# Altium project MicrocontrollerBoard.PrjPcb
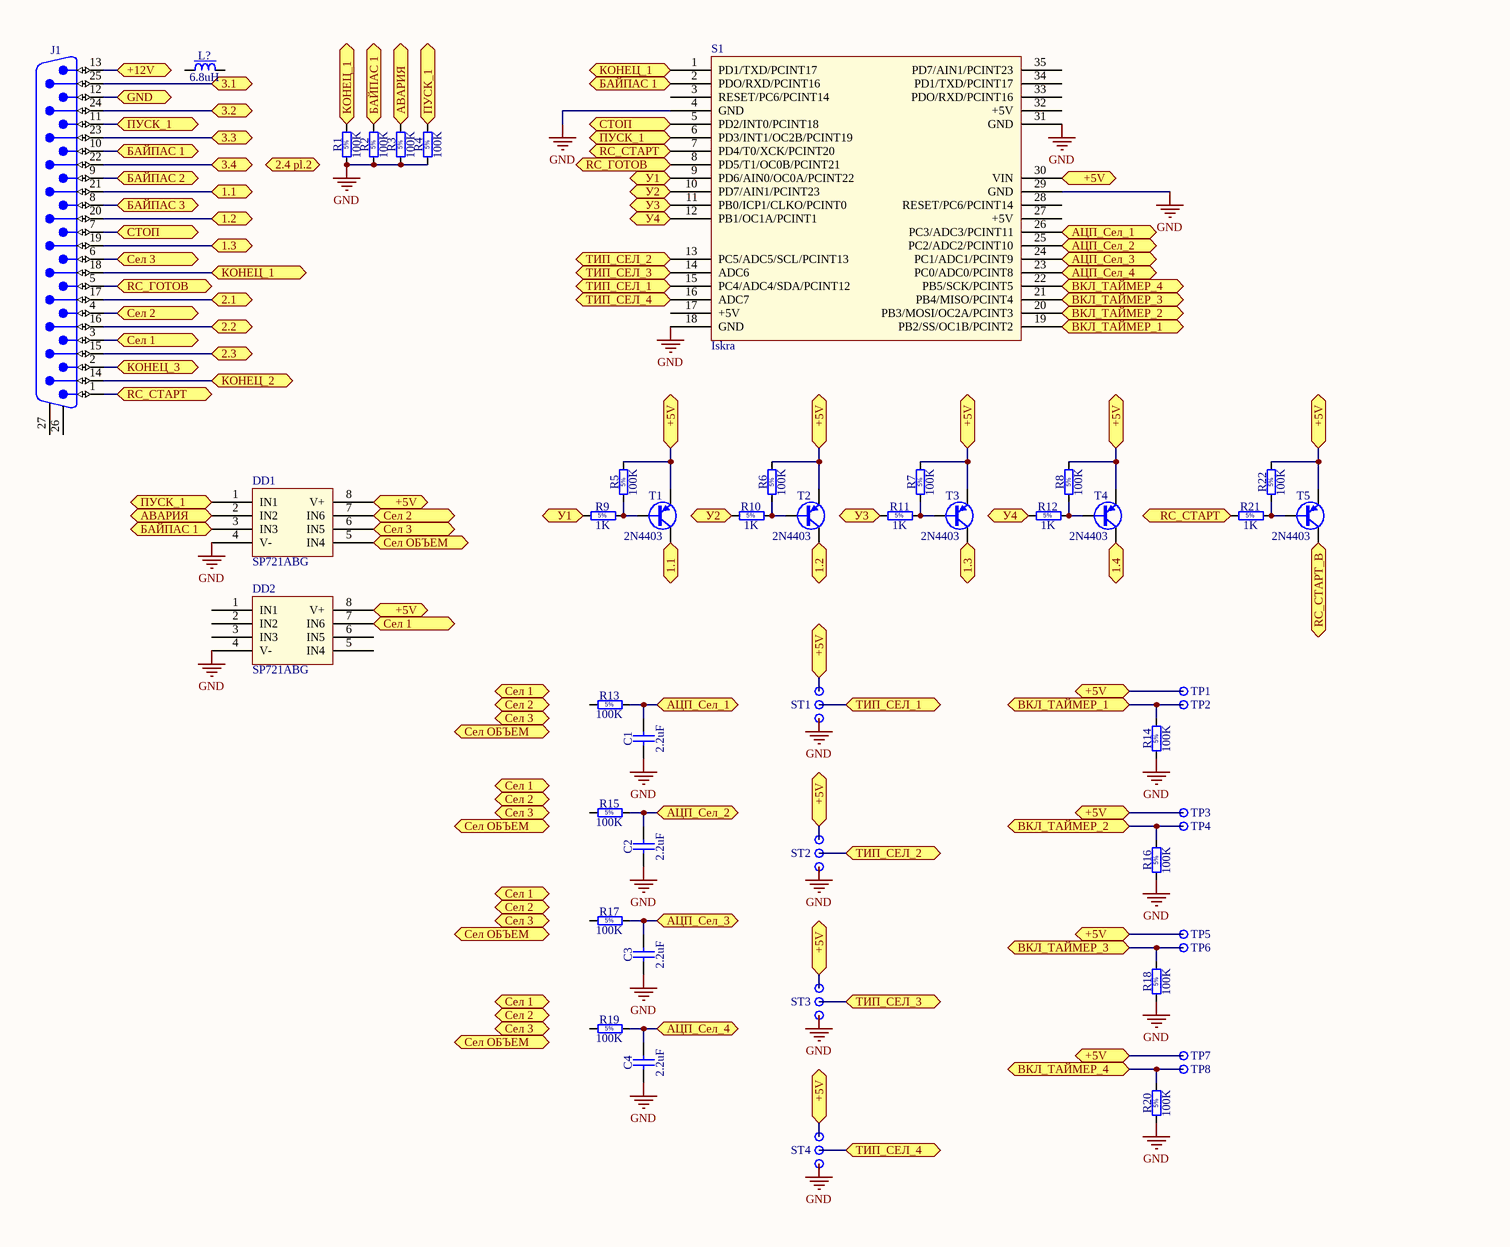
[diagram p0: TimerModule.SchDoc, left]
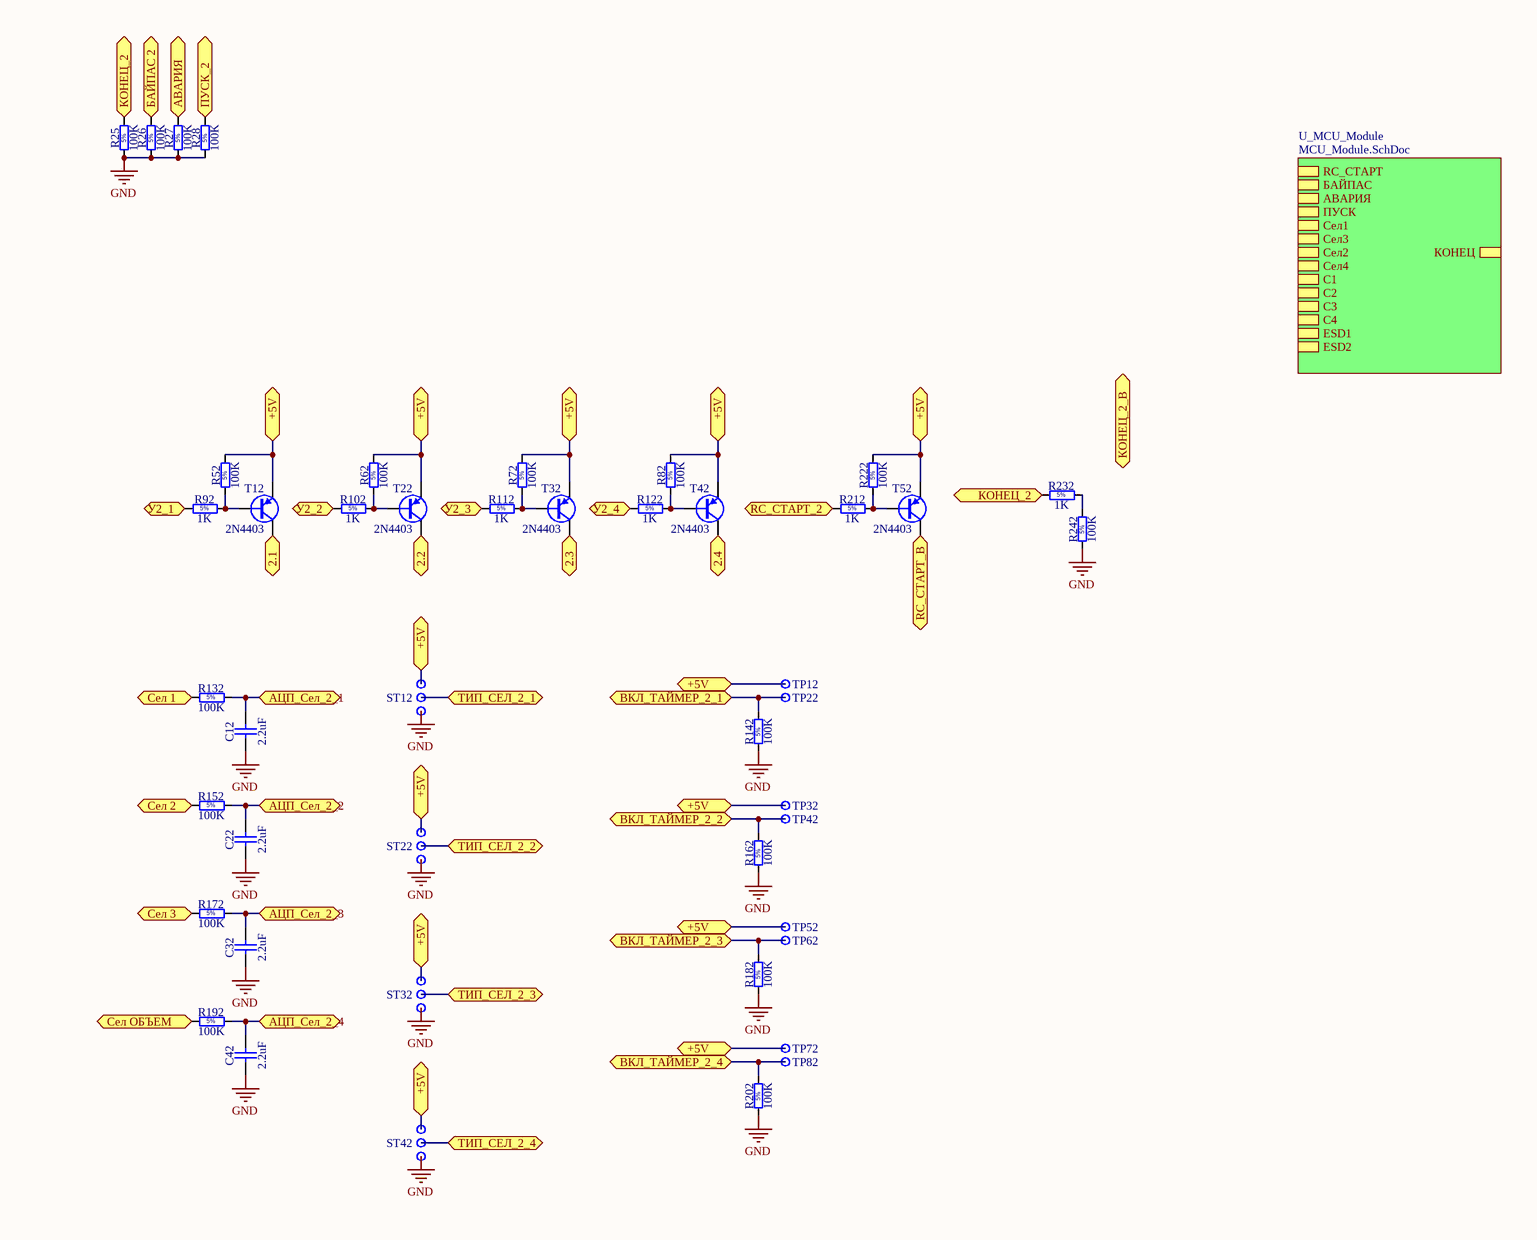
[diagram p1: TimerModule.SchDoc, right]
4 sheets, 159 parts. Net scope: hierarchical (ports join the sheet entries above them; power ports are global).
Board file: Timermodule.PcbDoc
Sheets:
  TimerModule.SchDoc
    U_MCU_Module = MCU_Module.SchDoc
      PNP1 = PNP_Cell.SchDoc
      PNP2 = PNP_Cell.SchDoc
      PNP3 = PNP_Cell.SchDoc
      PNP4 = PNP_Cell.SchDoc
      FILT1 = ADC_Filter_Cell.SchDoc
      FILT2 = ADC_Filter_Cell.SchDoc
      FILT3 = ADC_Filter_Cell.SchDoc
      FILT4 = ADC_Filter_Cell.SchDoc
      U_PNP_Cell = PNP_Cell.SchDoc

## Sheet TimerModule.SchDoc
size A1

### Parts
(Parts that share a designator on the sheet are numbered #1, #2 ... from top to bottom, then left to right.)
B1  Plated Hole  [MTG300_700]  (value not drawn)
B2  Plated Hole  [MTG300_700]  (value not drawn)
B3  Plated Hole  [MTG300_700]  (value not drawn)
B4  Plated Hole  [MTG300_700]  (value not drawn)
B5  Plated Hole  [MTG300_700]  (value not drawn)
B6  Plated Hole  [MTG300_700]  (value not drawn)
B7  Plated Hole  [MTG300_700]  (value not drawn)
B8  Plated Hole  [MTG300_700]  (value not drawn)
B12#1  Plated Hole  [MTG300_700]  (value not drawn)
B22#1  Plated Hole  [MTG300_700]  (value not drawn)
B32  Plated Hole  [MTG300_700]  (value not drawn)
B42  Plated Hole  [MTG300_700]  (value not drawn)
B52  Plated Hole  [MTG300_700]  (value not drawn)
B62  Plated Hole  [MTG300_700]  (value not drawn)
B72  Plated Hole  [MTG300_700]  (value not drawn)
B82  Plated Hole  [MTG300_700]  (value not drawn)
C1  2.2uF  [CAPRR254-254X381X508]
C2  2.2uF  [CAPRR254-254X381X508]
C3  2.2uF  [CAPRR254-254X381X508]
C4  2.2uF  [CAPRR254-254X381X508]
C12  2.2uF  [CAPRR254-254X381X508]
C22  2.2uF  [CAPRR254-254X381X508]
C32  2.2uF  [CAPRR254-254X381X508]
C42  2.2uF  [CAPRR254-254X381X508]
DD1#1  SP721ABG  [SOIC127P594X363-8N]
DD2#1  SP721ABG  [SOIC127P594X363-8N]
J1  D-Sub  [AMPHENOL_L717DFB25P1ATN]  (value not drawn)
L?  6.8uH  [IND_WURTH_WE-TI]
R1#1  100K  [RES_ARCOL_RCC025]
R2#1  100K  [RES_ARCOL_RCC025]
R3#1  100K  [RES_ARCOL_RCC025]
R4#1  100K  [RES_ARCOL_RCC025]
R5  100K  [RES_ARCOL_RCC025]
R6  100K  [RES_ARCOL_RCC025]
R7  100K  [RES_ARCOL_RCC025]
R8  100K  [RES_ARCOL_RCC025]
R9  1K  [RES_ARCOL_RCC025]
R10  1K  [RES_ARCOL_RCC025]
R11  1K  [RES_ARCOL_RCC025]
R12  1K  [RES_ARCOL_RCC025]
R13  100K  [RES_ARCOL_RCC025]
R14  100K  [RES_ARCOL_RCC025]
R15  100K  [RES_ARCOL_RCC025]
R16  100K  [RES_ARCOL_RCC025]
R17  100K  [RES_ARCOL_RCC025]
R18  100K  [RES_ARCOL_RCC025]
R19  100K  [RES_ARCOL_RCC025]
R20  100K  [RES_ARCOL_RCC025]
R21  1K  [RES_ARCOL_RCC025]
R22  100K  [RES_ARCOL_RCC025]
R25  100K  [RES_ARCOL_RCC025]
R26  100K  [RES_ARCOL_RCC025]
R27  100K  [RES_ARCOL_RCC025]
R28  100K  [RES_ARCOL_RCC025]
R52  100K  [RES_ARCOL_RCC025]
R62  100K  [RES_ARCOL_RCC025]
R72  100K  [RES_ARCOL_RCC025]
R82  100K  [RES_ARCOL_RCC025]
R92  1K  [RES_ARCOL_RCC025]
R102  1K  [RES_ARCOL_RCC025]
R112  1K  [RES_ARCOL_RCC025]
R122  1K  [RES_ARCOL_RCC025]
R132  100K  [RES_ARCOL_RCC025]
R142  100K  [RES_ARCOL_RCC025]
R152  100K  [RES_ARCOL_RCC025]
R162  100K  [RES_ARCOL_RCC025]
R172  100K  [RES_ARCOL_RCC025]
R182  100K  [RES_ARCOL_RCC025]
R192  100K  [RES_ARCOL_RCC025]
R202  100K  [RES_ARCOL_RCC025]
R212  1K  [RES_ARCOL_RCC025]
R222  100K  [RES_ARCOL_RCC025]
R232  1K  [RES_ARCOL_RCC025]
R242  100K  [RES_ARCOL_RCC025]
S1#1  Iskra  [Iskra]
ST1#1  Plated Hole  [MTG300_700]  (value not drawn)
ST2#1  Plated Hole  [MTG300_700]  (value not drawn)
ST3#1  Plated Hole  [MTG300_700]  (value not drawn)
ST4#1  Plated Hole  [MTG300_700]  (value not drawn)
ST12  Plated Hole  [MTG300_700]  (value not drawn)
ST22  Plated Hole  [MTG300_700]  (value not drawn)
ST32  Plated Hole  [MTG300_700]  (value not drawn)
ST42  Plated Hole  [MTG300_700]  (value not drawn)
T1  2N4403  [TO-92AA-P254]
T2  2N4403  [TO-92AA-P254]
T3  2N4403  [TO-92AA-P254]
T4  2N4403  [TO-92AA-P254]
T5  2N4403  [TO-92AA-P254]
T12  2N4403  [TO-92AA-P254]
T22  2N4403  [TO-92AA-P254]
T32  2N4403  [TO-92AA-P254]
T42  2N4403  [TO-92AA-P254]
T52  2N4403  [TO-92AA-P254]
TP1#1  Test Point  [TPS127]  (value not drawn)
TP2#1  Test Point  [TPS127]  (value not drawn)
TP3#1  Test Point  [TPS127]  (value not drawn)
TP4#1  Test Point  [TPS127]  (value not drawn)
TP5#1  Test Point  [TPS127]  (value not drawn)
TP6  Test Point  [TPS127]  (value not drawn)
TP7  Test Point  [TPS127]  (value not drawn)
TP8  Test Point  [TPS127]  (value not drawn)
TP12  Test Point  [TPS127]  (value not drawn)
TP22  Test Point  [TPS127]  (value not drawn)
TP32  Test Point  [TPS127]  (value not drawn)
TP42  Test Point  [TPS127]  (value not drawn)
TP52  Test Point  [TPS127]  (value not drawn)
TP62  Test Point  [TPS127]  (value not drawn)
TP72  Test Point  [TPS127]  (value not drawn)
TP82  Test Point  [TPS127]  (value not drawn)

### Sub-sheets
U_MCU_Module = MCU_Module.SchDoc: RC_СТАРТ, БАЙПАС, АВАРИЯ, ПУСК, Сел1, Сел3, Сел2, Сел4, С1, С2, С3, С4, ESD1, ESD2, КОНЕЦ

### Ports
1.1, 1.2, 1.3, 1.4, 2.1, 2.2, 2.3, 2.4, 2.4 pl.2, 3.1, 3.2, 3.3, 3.4, +5V, +12V, GND, RC_ГОТОВ, RC_СТАРТ, RC_СТАРТ_2, RC_СТАРТ_В, АВАРИЯ, АЦП_Сел_1, АЦП_Сел_2, АЦП_Сел_2_1, АЦП_Сел_2_2, АЦП_Сел_2_3, АЦП_Сел_2_4, АЦП_Сел_3, АЦП_Сел_4, БАЙПАС 1, БАЙПАС 2, БАЙПАС 3, ВКЛ_ТАЙМЕР_1, ВКЛ_ТАЙМЕР_2, ВКЛ_ТАЙМЕР_2_1, ВКЛ_ТАЙМЕР_2_2, ВКЛ_ТАЙМЕР_2_3, ВКЛ_ТАЙМЕР_2_4, ВКЛ_ТАЙМЕР_3, ВКЛ_ТАЙМЕР_4, КОНЕЦ_1, КОНЕЦ_2, КОНЕЦ_2_В, КОНЕЦ_3, ПУСК_1, ПУСК_2, Сел 1, Сел 2, Сел 3, Сел ОБЪЕМ, СТОП, ТИП_СЕЛ_1, ТИП_СЕЛ_2, ТИП_СЕЛ_2_1, ТИП_СЕЛ_2_2, ТИП_СЕЛ_2_3, ТИП_СЕЛ_2_4, ТИП_СЕЛ_3, ТИП_СЕЛ_4, У1, У2, У2_1, У2_2, У2_3, У2_4, У3, У4

### Nets
GND: B2.1 B4.1 B6.1 B8.1 B22#1.1 B42.1 B62.1 B82.1 C1.1 C2.1 C3.1 C4.1 C12.1 C22.1 C32.1 C42.1 DD1#1.4(V-) DD2#1.4(V-) R1#1.1 R2#1.1 R3#1.1 R4#1.1 R14.1 R16.1 R18.1 R20.1 R25.1 R26.1 R27.1 R28.1 R142.1 R162.1 R182.1 R202.1 R242.1 S1#1.4(GND) S1#1.18(GND) S1#1.29(GND) S1#1.31(GND)
NetB1_1: B1.1 B3.1 B5.1 B7.1 B12#1.1 B32.1 B52.1 B72.1 DD1#1.8(V+) DD2#1.8(V+) R5.2 R6.2 R7.2 R8.2 R22.2 R52.2 R62.2 R72.2 R82.2 R222.2 S1#1.30(VIN) T1.1(E) T2.1(E) T3.1(E) T4.1(E) T5.1(E) T12.1(E) T22.1(E) T32.1(E) T42.1(E) T52.1(E) TP1#1.1 TP3#1.1 TP5#1.1 TP7.1 TP12.1 TP32.1 TP52.1 TP72.1 ; port +5V
NetC1_2: C1.2 R13.2 S1#1.26(PC3/ADC3/PCINT11) ; port АЦП_Сел_1
NetC2_2: C2.2 R15.2 S1#1.25(PC2/ADC2/PCINT10) ; port АЦП_Сел_2
NetC3_2: C3.2 R17.2 S1#1.24(PC1/ADC1/PCINT9) ; port АЦП_Сел_3
NetC4_2: C4.2 R19.2 S1#1.23(PC0/ADC0/PCINT8) ; port АЦП_Сел_4
NetC12_2: C12.2 R132.2 ; port АЦП_Сел_2_1
NetC22_2: C22.2 R152.2 ; port АЦП_Сел_2_2
NetC32_2: C32.2 R172.2 ; port АЦП_Сел_2_3
NetC42_2: C42.2 R192.2 ; port АЦП_Сел_2_4
NetDD1#1_1: DD1#1.1(IN1) J1.11 R4#1.2 S1#1.6(PD3/INT1/OC2B/PCINT19) ; port ПУСК_1
NetDD1#1_2: DD1#1.2(IN2) R3#1.2 R27.2 ; port АВАРИЯ
NetDD1#1_3: DD1#1.3(IN3) J1.10 R2#1.2 S1#1.2(PDO/RXD/PCINT16) ; port БАЙПАС 1
NetDD1#1_5: DD1#1.5(IN4) R192.1 ; port Сел ОБЪЕМ
NetDD1#1_6: DD1#1.6(IN5) J1.6 R172.1 ; port Сел 3
NetDD1#1_7: DD1#1.7(IN6) J1.4 R152.1 ; port Сел 2
NetDD2#1_7: DD2#1.7(IN6) J1.3 R132.1 ; port Сел 1
NetJ1_1: J1.1 R21.1 S1#1.7(PD4/T0/XCK/PCINT20) ; port RC_СТАРТ
NetJ1_2: J1.2 ; port КОНЕЦ_3
NetJ1_5: J1.5 S1#1.8(PD5/T1/OC0B/PCINT21) ; port RC_ГОТОВ
NetJ1_7: J1.7 S1#1.5(PD2/INT0/PCINT18) ; port СТОП
NetJ1_8: J1.8 ; port БАЙПАС 3
NetJ1_9: J1.9 R26.2 ; port БАЙПАС 2
NetJ1_12: J1.12 ; port GND
NetJ1_13: J1.13 ; port +12V
NetJ1_14: J1.14 R25.2 R232.1 ; port КОНЕЦ_2
NetJ1_15: J1.15 T32.3(C) ; port 2.3
NetJ1_16: J1.16 T22.3(C) ; port 2.2
NetJ1_17: J1.17 T12.3(C) ; port 2.1
NetJ1_18: J1.18 R1#1.2 S1#1.1(PD1/TXD/PCINT17) ; port КОНЕЦ_1
NetJ1_19: J1.19 T3.3(C) ; port 1.3
NetJ1_20: J1.20 T2.3(C) ; port 1.2
NetJ1_21: J1.21 T1.3(C) ; port 1.1
NetJ1_22: J1.22 ; port 3.4
NetJ1_23: J1.23 ; port 3.3
NetJ1_24: J1.24 ; port 3.2
NetJ1_25: J1.25 ; port 3.1
NetR5_1: R5.1 R9.2 T1.2(B)
NetR6_1: R6.1 R10.2 T2.2(B)
NetR7_1: R7.1 R11.2 T3.2(B)
NetR8_1: R8.1 R12.2 T4.2(B)
NetR9_1: R9.1 S1#1.9(PD6/AIN0/OC0A/PCINT22) ; port У1
NetR10_1: R10.1 S1#1.10(PD7/AIN1/PCINT23) ; port У2
NetR11_1: R11.1 S1#1.11(PB0/ICP1/CLKO/PCINT0) ; port У3
NetR12_1: R12.1 S1#1.12(PB1/OC1A/PCINT1) ; port У4
NetR14_2: R14.2 S1#1.19(PB2/SS/OC1B/PCINT2) TP2#1.1 ; port ВКЛ_ТАЙМЕР_1
NetR16_2: R16.2 S1#1.20(PB3/MOSI/OC2A/PCINT3) TP4#1.1 ; port ВКЛ_ТАЙМЕР_2
NetR18_2: R18.2 S1#1.21(PB4/MISO/PCINT4) TP6.1 ; port ВКЛ_ТАЙМЕР_3
NetR20_2: R20.2 S1#1.22(PB5/SCK/PCINT5) TP8.1 ; port ВКЛ_ТАЙМЕР_4
NetR21_2: R21.2 R22.1 T5.2(B)
NetR28_2: R28.2 ; port ПУСК_2
NetR52_1: R52.1 R92.2 T12.2(B)
NetR62_1: R62.1 R102.2 T22.2(B)
NetR72_1: R72.1 R112.2 T32.2(B)
NetR82_1: R82.1 R122.2 T42.2(B)
NetR92_1: R92.1 ; port У2_1
NetR102_1: R102.1 ; port У2_2
NetR112_1: R112.1 ; port У2_3
NetR122_1: R122.1 ; port У2_4
NetR142_2: R142.2 TP22.1 ; port ВКЛ_ТАЙМЕР_2_1
NetR162_2: R162.2 TP42.1 ; port ВКЛ_ТАЙМЕР_2_2
NetR182_2: R182.2 TP62.1 ; port ВКЛ_ТАЙМЕР_2_3
NetR202_2: R202.2 TP82.1 ; port ВКЛ_ТАЙМЕР_2_4
NetR212_1: R212.1 ; port RC_СТАРТ_2
NetR212_2: R212.2 R222.1 T52.2(B)
NetR232_2: R232.2 R242.2
NetS1#1_13: S1#1.13(PC5/ADC5/SCL/PCINT13) ST2#1.1 ; port ТИП_СЕЛ_2
NetS1#1_14: S1#1.14(ADC6) ST3#1.1 ; port ТИП_СЕЛ_3
NetS1#1_15: S1#1.15(PC4/ADC4/SDA/PCINT12) ST1#1.1 ; port ТИП_СЕЛ_1
NetS1#1_16: S1#1.16(ADC7) ST4#1.1 ; port ТИП_СЕЛ_4
NetST12_1: ST12.1 ; port ТИП_СЕЛ_2_1
NetST22_1: ST22.1 ; port ТИП_СЕЛ_2_2
NetST32_1: ST32.1 ; port ТИП_СЕЛ_2_3
NetST42_1: ST42.1 ; port ТИП_СЕЛ_2_4
NetT4_3: T4.3(C) ; port 1.4
NetT5_3: T5.3(C) T52.3(C) ; port RC_СТАРТ_В
NetT42_3: T42.3(C) ; port 2.4

Not connected (* = marked no-connect by the designer): DD2#1 1(IN1) 2(IN2) 3(IN3) 5(IN4) 6(IN5); J1 26 27; L? 1 2; R13 1; R15 1; R17 1; R19 1; S1#1 3(RESET/PC6/PCINT14) 17(+5V) 27(+5V) 28(RESET/PC6/PCINT14) 32(+5V) 33(PDO/RXD/PCINT16) 34(PD1/TXD/PCINT17) 35(PD7/AIN1/PCINT23)

### Notes on the sheet
- (in symbol RCF_5K1_5%_0.25W_+10-6PPM_ARCOL_RCC025) 5%

### Library data of the parts
B1-B8 B12#1 B22#1 B32 B42 B52 B62 B72 B82 ST1#1 ST2#1 ST3#1 ST4#1 ST12 ST22 ST32 ST42 = PLATED_HOLE3.0_PAD7.0: Single Terminal Socket; Part Description: Plated Through Hole: Hole Dia.=3.0mm Pad Dia.=7.0mm; Mounted: No; Table: Pads; Part Number: PLATED_HOLE3.0_PAD7.0; Component Kind: Standard (No BOM); Component Type: Standard (No BOM); Pin Count: 1; Family: Plated Hole; Socket: No; SMD: No; Status: None; ComponentHeight: 0mm; Author: CERN DEM JLC; CreateDate: 26.05.2008; LatestRevisionDate: 26.05.2008; PackageDescription: Plated Through Hole: Hole Dia.=3.0mm Pad Dia.=7.0mm
C1-C4 C12 C22 C32 C42 = CCR_15PF_100V_5%_COG_254-254X381X508: Non-polarised capacitor; Part Description: Radial Lead Type Multilayer Ceramic Capacitor; Manufacturer: GENERIC; Manufacturer1 Part Number: SR151A150JAR; Voltage: 100VDC; TC: COG; Tolerance: ±5%; Table: Capacitors THD; Part Number: CCR_15PF_100V_5%_COG_254-254X381X508; Component Kind: Standard; Component Type: Standard; Pin Count: 2; Value: 2.2uF; Status: None; Manufacturer Part Number: CCR_15PF_100V_5%_COG_254-254X381X508; Case: LS2.54 W2.54 x L3.81 x H5.84; Mounted: Yes; Socket: No; SMD: No; ComponentHeight: 5.08mm; Manufacturer1 Example: AVX; Manufacturer1 ComponentHeight: 5.08mm; HelpURL: \\cern.ch\dfs\Applications\Altium\Datasheets\CCR_AVX_SR15.pdf; Author: CERN DEM JLC; CreateDate: 16.12.2010; LatestRevisionDate: 16.12.2010
J1 = AMPHENOL_L717DFB25P1ATN: Connector D-sub 25 Male; Part Description: Right Angled D-Sub 25 Male Contacts with Metal Bracket and Front Female Screwlock (UNC4-40); Part Number: AMPHENOL_L717DFB25P1ATN; Component Kind: Standard; Component Type: Standard; Pin Count: 27; Family: D-Sub; Mounted: Yes; Socket: No; SMD: No; Status: None; Manufacturer: AMPHENOL; Manufacturer Part Number: L717DFB25P1ATN; ComponentHeight: 13.4mm; HelpURL: \\cern.ch\dfs\Applications\Altium\Datasheets\AMPHENOL_L717DFB25P1ATN.pdf; Author: CERN DEM JLC; CreateDate: 03.06.2009; LatestRevisionDate: 14.07.2011; Table: AMPHENOL
L? = IND_6.8UH_20%_WURTH_WE-TI: Inductor With Magnetic core; Part Description: Radial Leaded Filter Choke Serie WE-TI; Manufacturer: WURTH ELEKTRONIK; Manufacturer Part Number: 744772068; Power: 3.8A; Resistance: 0.025R; Tolerance: ±20%; Table: Inductors THD; Part Number: IND_6.8UH_20%_WURTH_WE-TI; Component Kind: Standard; Component Type: Standard; Pin Count: 2; Value: 6.8uH; Case: LS5.08 H10 x D8.3; Mounted: Yes; Socket: No; SMD: No; ComponentHeight: 10mm; HelpURL: \\cern.ch\dfs\Applications\Altium\Datasheets\IND_WURTH_WE-TI_744772068.pdf; Author: CERN DEM JLC; CreateDate: 11.11.2008; LatestRevisionDate: 09.04.2014
R1#1 R2#1 R3#1 R4#1 R5-R22 R25-R28 R52 R62 R72 R82 R92 R102 R112 R122 R132 R142 R152 R162 R172 R182 R192 R202 R212 R222 R232 R242 = RCF_5K1_5%_0.25W_+10-6PPM_ARCOL_RCC025: Resistor - 5%; Part Description: Solid Carbon Resistor RCC Series; Manufacturer: ARCOL; Manufacturer Part Number: RCC025 5k1 J; Power: 0.25W; TC: +10-6ppm/°C; Table: Resistors THD; Part Number: RCF_5K1_5%_0.25W_+10-6PPM_ARCOL_RCC025; Component Kind: Standard; Component Type: Standard; Pin Count: 2; Status: None; Tolerance: ±5%; Case: LS10.16 L6.3 x D2.4; Mounted: Yes; Socket: No; SMD: No; ComponentHeight: 2.5mm; HelpURL: \\cern.ch\dfs\Applications\Altium\Datasheets\RCF_ARCOL_RCC025.pdf; Author: CERN DEM JLC; CreateDate: 30.10.2013; LatestRevisionDate: 30.10.2013
  R1#1 R2#1 R3#1 R4#1 R5-R8 R13-R20 R22 R25-R28 R52 R62 R72 R82 R132 R142 R152 R162 R172 R182 R192 R202 R222 R242: Value: 100K
  R9-R12 R21 R92 R102 R112 R122 R212 R232: Value: 1K
S1#1 = Iskra_Holder
T1-T5 T12 T22 T32 T42 T52 = 2N3906RL1G: PNP Transistor; Part Description: 40V 200mA PNP General Purpose Amplifier; Manufacturer: ON SEMICONDUCTOR; Table: Transistors; Part Number: 2N3906RL1G; Component Kind: Standard; Component Type: Standard; Device: 2N3906RL1G; PackageDescription: TO-92 (TO226), Pitch 2.54mm, Flat Index, 3 In-Line, Bent Leads, Body Dia. 5.3mm; Manufacturer Part Number: 2N3906RL1G; Pin Count: 3; Case: TO-92; Mounted: Yes; Socket: No; SMD: No; ComponentHeight: 7.7mm; HelpURL: \\cern.ch\dfs\Applications\Altium\Datasheets\2N3906RL1G.pdf; Author: CERN DEM JLC; CreateDate: 23.09.2009; LatestRevisionDate: 23.09.2009
TP1#1 TP2#1 TP3#1 TP4#1 TP5#1 TP6-TP8 TP12 TP22 TP32 TP42 TP52 TP62 TP72 TP82 = SMD_PAD_1.27X1.27MM: Part Description: 1.27mm x 1.27mm PCB Copper Area (SMD Test Point); Mounted: No; Table: Pads; Part Number: SMD_PAD_1.27X1.27MM; Component Kind: Standard (No BOM); Component Type: Standard (No BOM); Pin Count: 1; Family: Test Point; Socket: No; SMD: Yes; Status: None; ComponentHeight: 0mm; Author: CERN DEM JLC; CreateDate: 12.01.2008; LatestRevisionDate: 12.01.2008; PackageDescription: 1.27mm x 1.27mm PCB Copper Area (SMD Test Point)

## Sheet MCU_Module.SchDoc
size A3
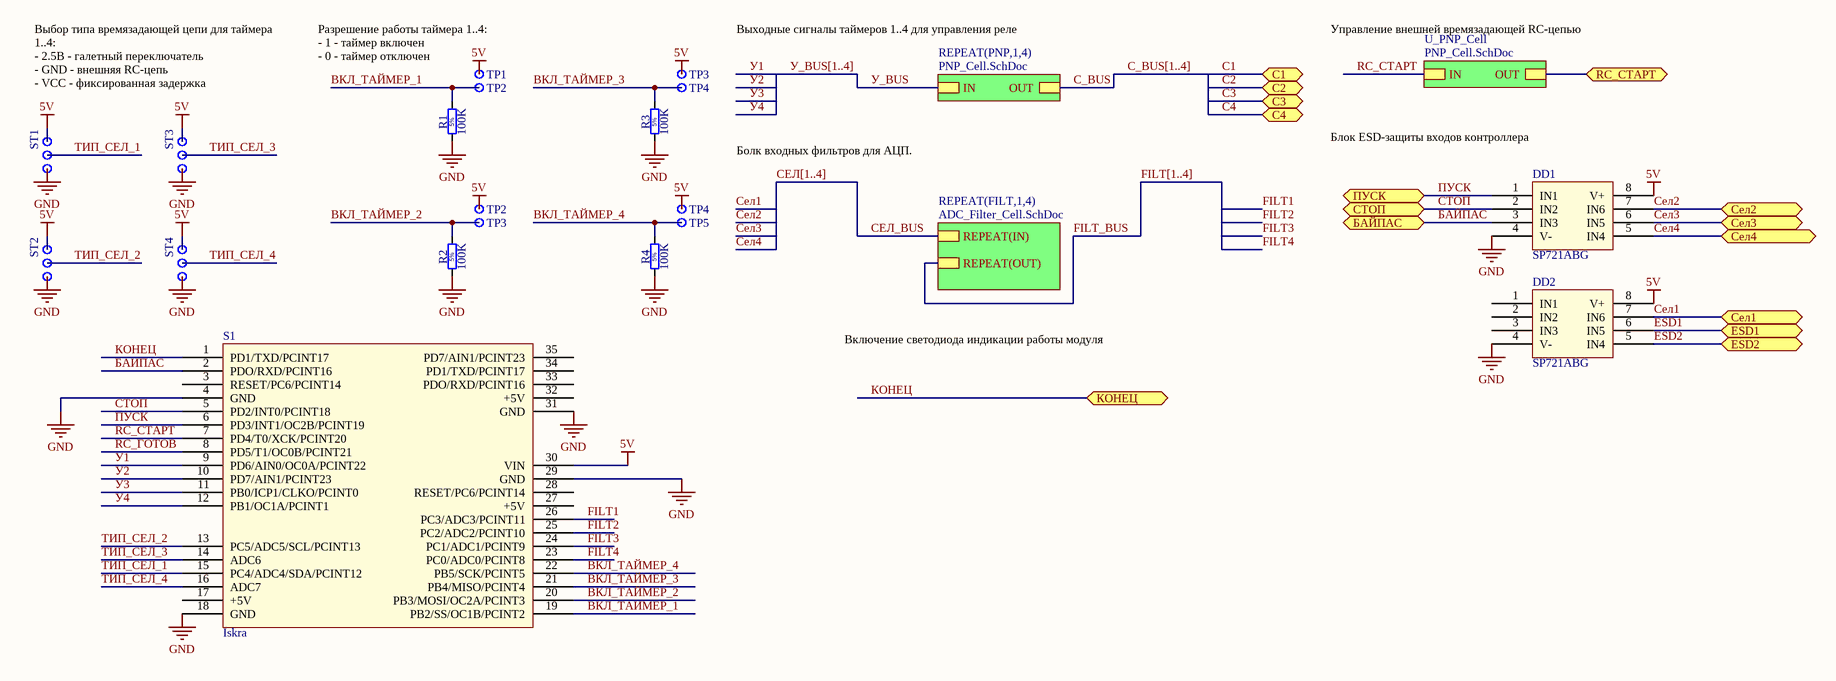
[diagram p2: MCU_Module.SchDoc]

### Parts
(Parts that share a designator on the sheet are numbered #1, #2 ... from top to bottom, then left to right.)
B12#2  Plated Hole  [MTG300_700]  (value not drawn)
B13  Plated Hole  [MTG300_700]  (value not drawn)
B14  Plated Hole  [MTG300_700]  (value not drawn)
B15  Plated Hole  [MTG300_700]  (value not drawn)
B22#2  Plated Hole  [MTG300_700]  (value not drawn)
B23  Plated Hole  [MTG300_700]  (value not drawn)
B24  Plated Hole  [MTG300_700]  (value not drawn)
B25  Plated Hole  [MTG300_700]  (value not drawn)
DD1#2  SP721ABG  [SOIC127P594X363-8N]
DD2#2  SP721ABG  [SOIC127P594X363-8N]
R1#2  100K  [RES_ARCOL_RCC025]
R2#2  100K  [RES_ARCOL_RCC025]
R3#2  100K  [RES_ARCOL_RCC025]
R4#2  100K  [RES_ARCOL_RCC025]
S1#2  Iskra  [Iskra]
ST1#2  Plated Hole  [MTG300_700]  (value not drawn)
ST2#2  Plated Hole  [MTG300_700]  (value not drawn)
ST3#2  Plated Hole  [MTG300_700]  (value not drawn)
ST4#2  Plated Hole  [MTG300_700]  (value not drawn)
TP1#2  Test Point  [TPS127]  (value not drawn)
TP2#2  Test Point  [TPS127]  (value not drawn)
TP2#3  Test Point  [TPS127]  (value not drawn)
TP3#2  Test Point  [TPS127]  (value not drawn)
TP3#3  Test Point  [TPS127]  (value not drawn)
TP4#2  Test Point  [TPS127]  (value not drawn)
TP4#3  Test Point  [TPS127]  (value not drawn)
TP5#2  Test Point  [TPS127]  (value not drawn)

### Sub-sheets
REPEAT(FILT,1,4) = ADC_Filter_Cell.SchDoc: REPEAT(IN), REPEAT(OUT)
REPEAT(PNP,1,4) = PNP_Cell.SchDoc: OUT, IN
U_PNP_Cell = PNP_Cell.SchDoc: OUT, IN

### Ports
ESD1, ESD2, RC_СТАРТ, БАЙПАС, КОНЕЦ, ПУСК, С1, С2, С3, С4, Сел1, Сел2, Сел3, Сел4, СТОП

### Nets
5V: B12#2.1 B13.1 B14.1 B15.1 DD1#2.8(V+) DD2#2.8(V+) S1#2.30(VIN) TP1#2.1 TP2#3.1 TP3#2.1 TP4#3.1
GND: B22#2.1 B23.1 B24.1 B25.1 DD1#2.4(V-) DD2#2.4(V-) R1#2.1 R2#2.1 R3#2.1 R4#2.1 S1#2.4(GND) S1#2.18(GND) S1#2.29(GND) S1#2.31(GND)
C1: port С1
C2: port С2
C3: port С3
C4: port С4
ESD1: DD2#2.6(IN5) ; port ESD1
ESD2: DD2#2.5(IN4) ; port ESD2
FILT1: S1#2.26(PC3/ADC3/PCINT11)
FILT2: S1#2.25(PC2/ADC2/PCINT10)
FILT3: S1#2.24(PC1/ADC1/PCINT9)
FILT4: S1#2.23(PC0/ADC0/PCINT8)
FILT_BUS: sheet REPEAT(FILT,1,4)/REPEAT(OUT)
RC_ГОТОВ: S1#2.8(PD5/T1/OC0B/PCINT21)
RC_СТАРТ: S1#2.7(PD4/T0/XCK/PCINT20) ; sheet U_PNP_Cell/IN
БАЙПАС: DD1#2.3(IN3) S1#2.2(PDO/RXD/PCINT16) ; port БАЙПАС
ВКЛ_ТАЙМЕР_1: R1#2.2 S1#2.19(PB2/SS/OC1B/PCINT2) TP2#2.1
ВКЛ_ТАЙМЕР_2: R2#2.2 S1#2.20(PB3/MOSI/OC2A/PCINT3) TP3#3.1
ВКЛ_ТАЙМЕР_3: R3#2.2 S1#2.21(PB4/MISO/PCINT4) TP4#2.1
ВКЛ_ТАЙМЕР_4: R4#2.2 S1#2.22(PB5/SCK/PCINT5) TP5#2.1
КОНЕЦ: S1#2.1(PD1/TXD/PCINT17) ; port КОНЕЦ
ПУСК: DD1#2.1(IN1) S1#2.6(PD3/INT1/OC2B/PCINT19) ; port ПУСК
Сел1: DD2#2.7(IN6) ; port Сел1
Сел2: DD1#2.7(IN6) ; port Сел2
Сел3: DD1#2.6(IN5) ; port Сел3
Сел4: DD1#2.5(IN4) ; port Сел4
СЕЛ_BUS: sheet REPEAT(FILT,1,4)/REPEAT(IN)
СТОП: DD1#2.2(IN2) S1#2.5(PD2/INT0/PCINT18) ; port СТОП
ТИП_СЕЛ_1: S1#2.15(PC4/ADC4/SDA/PCINT12) ST1#2.1
ТИП_СЕЛ_2: S1#2.13(PC5/ADC5/SCL/PCINT13) ST2#2.1
ТИП_СЕЛ_3: S1#2.14(ADC6) ST3#2.1
ТИП_СЕЛ_4: S1#2.16(ADC7) ST4#2.1
У1: S1#2.9(PD6/AIN0/OC0A/PCINT22)
У2: S1#2.10(PD7/AIN1/PCINT23)
У3: S1#2.11(PB0/ICP1/CLKO/PCINT0)
У4: S1#2.12(PB1/OC1A/PCINT1)
NetT1_U_PNP_Cell_3: port RC_СТАРТ, sheet U_PNP_Cell/OUT

Not connected (* = marked no-connect by the designer): DD2#2 1(IN1) 2(IN2) 3(IN3); S1#2 3(RESET/PC6/PCINT14) 17(+5V) 27(+5V) 28(RESET/PC6/PCINT14) 32(+5V) 33(PDO/RXD/PCINT16) 34(PD1/TXD/PCINT17) 35(PD7/AIN1/PCINT23)

### Buses and harness runs
bus C_BUS[1..4]
bus FILT[1..4]
bus СЕЛ[1..4]
bus У_BUS[1..4]

### Notes on the sheet
- (near TP1#2) Разрешение работы таймера 1..4:
  - 1 - таймер включен
  - 0 - таймер отключен
- Выходные сигналы таймеров 1..4 для управления реле
- Управление внешней времязадающей RC-цепью
- Выбор типа времязадающей цепи для таймера 1..4:
  - 2.5В - галетный переключатель
  - GND - внешняя RC-цепь
  - VCC - фиксированная задержка
- Болк входных фильтров для АЦП.
- (near DD1#2) Блок ESD-защиты входов контроллера
- Включение светодиода индикации работы модуля
- (in symbol RCF_5K1_5%_0.25W_+10-6PPM_ARCOL_RCC025) 5%

### Library data of the parts
B12#2 B13-B15 B22#2 B23-B25 ST1#2 ST2#2 ST3#2 ST4#2 = PLATED_HOLE3.0_PAD7.0: as B1 on sheet TimerModule; Part Number: PLATED_HOLE3.0_PAD7.0; Component Kind: Standard (No BOM); Component Type: Standard (No BOM); Pin Count: 1; Family: Plated Hole; Socket: No; SMD: No; Status: None; ComponentHeight: 0mm; Author: CERN DEM JLC; CreateDate: 26.05.2008; LatestRevisionDate: 26.05.2008; PackageDescription: Plated Through Hole: Hole Dia.=3.0mm Pad Dia.=7.0mm
R1#2 R2#2 R3#2 R4#2 = RCF_5K1_5%_0.25W_+10-6PPM_ARCOL_RCC025: as R1#1 on sheet TimerModule; Part Number: RCF_5K1_5%_0.25W_+10-6PPM_ARCOL_RCC025; Component Kind: Standard; Component Type: Standard; Pin Count: 2; Value: 100K; Status: None; Tolerance: ±5%; Case: LS10.16 L6.3 x D2.4; Mounted: Yes; Socket: No; SMD: No; ComponentHeight: 2.5mm; HelpURL: \\cern.ch\dfs\Applications\Altium\Datasheets\RCF_ARCOL_RCC025.pdf; Author: CERN DEM JLC; CreateDate: 30.10.2013; LatestRevisionDate: 30.10.2013
S1#2 = Iskra_Holder
TP1#2 TP2#2 TP2#3 TP3#2 TP3#3 TP4#2 TP4#3 TP5#2 = SMD_PAD_1.27X1.27MM: as TP1#1 on sheet TimerModule; Part Number: SMD_PAD_1.27X1.27MM; Component Kind: Standard (No BOM); Component Type: Standard (No BOM); Pin Count: 1; Family: Test Point; Socket: No; SMD: Yes; Status: None; ComponentHeight: 0mm; Author: CERN DEM JLC; CreateDate: 12.01.2008; LatestRevisionDate: 12.01.2008; PackageDescription: 1.27mm x 1.27mm PCB Copper Area (SMD Test Point)

## Sheet PNP_Cell.SchDoc
size A4
Used 5 times, as channels U_MCU_Module/PNP1, U_MCU_Module/PNP2, U_MCU_Module/PNP3, U_MCU_Module/PNP4, U_MCU_Module/U_PNP_Cell. Parts and nets are listed once, with the designators drawn on the sheet.
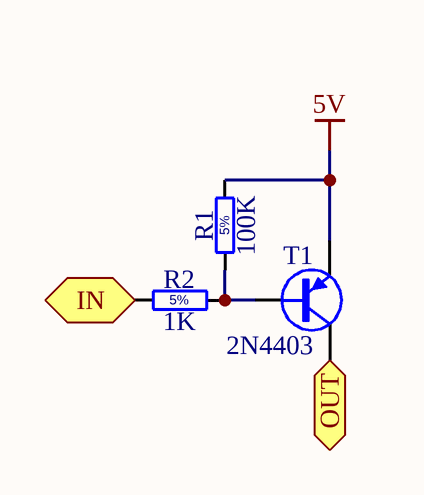
[diagram p3: PNP_Cell.SchDoc]

### Parts
R1  100K  [RES_ARCOL_RCC025]
R2  1K  [RES_ARCOL_RCC025]
T1  2N4403  [TO-92AA-P254]

### Ports
IN, OUT

### Nets
5V: R1.2 T1.1(E)
IN: R2.1 ; port IN
OUT: T1.3(C) ; port OUT
NetR1_1: R1.1 R2.2 T1.2(B)

### Channels
U_MCU_Module/PNP1: designators end in _PNP1; ports IN=У_BUS OUT=C_BUS
U_MCU_Module/PNP2: designators end in _PNP2; ports IN=У_BUS OUT=C_BUS
U_MCU_Module/PNP3: designators end in _PNP3; ports IN=У_BUS OUT=C_BUS
U_MCU_Module/PNP4: designators end in _PNP4; ports IN=У_BUS OUT=C_BUS
U_MCU_Module/U_PNP_Cell: designators end in _U_PNP_Cell; ports IN=RC_СТАРТ OUT=NetT1_U_PNP_Cell_3

### Notes on the sheet
- (in symbol RCF_5K1_5%_0.25W_+10-6PPM_ARCOL_RCC025) 5%

### Library data of the parts
R1 R2 = RCF_5K1_5%_0.25W_+10-6PPM_ARCOL_RCC025: as R1#1 on sheet TimerModule; Part Number: RCF_5K1_5%_0.25W_+10-6PPM_ARCOL_RCC025; Component Kind: Standard; Component Type: Standard; Pin Count: 2; Status: None; Tolerance: ±5%; Case: LS10.16 L6.3 x D2.4; Mounted: Yes; Socket: No; SMD: No; ComponentHeight: 2.5mm; HelpURL: \\cern.ch\dfs\Applications\Altium\Datasheets\RCF_ARCOL_RCC025.pdf; Author: CERN DEM JLC; CreateDate: 30.10.2013; LatestRevisionDate: 30.10.2013
  R1: Value: 100K
  R2: Value: 1K
T1 = 2N3906RL1G: as T1 on sheet TimerModule; Part Number: 2N3906RL1G; Component Kind: Standard; Component Type: Standard; Device: 2N3906RL1G; PackageDescription: TO-92 (TO226), Pitch 2.54mm, Flat Index, 3 In-Line, Bent Leads, Body Dia. 5.3mm; Manufacturer Part Number: 2N3906RL1G; Pin Count: 3; Case: TO-92; Mounted: Yes; Socket: No; SMD: No; ComponentHeight: 7.7mm; HelpURL: \\cern.ch\dfs\Applications\Altium\Datasheets\2N3906RL1G.pdf; Author: CERN DEM JLC; CreateDate: 23.09.2009; LatestRevisionDate: 23.09.2009

## Sheet ADC_Filter_Cell.SchDoc
size A4
Used 4 times, as channels U_MCU_Module/FILT1, U_MCU_Module/FILT2, U_MCU_Module/FILT3, U_MCU_Module/FILT4. Parts and nets are listed once, with the designators drawn on the sheet.
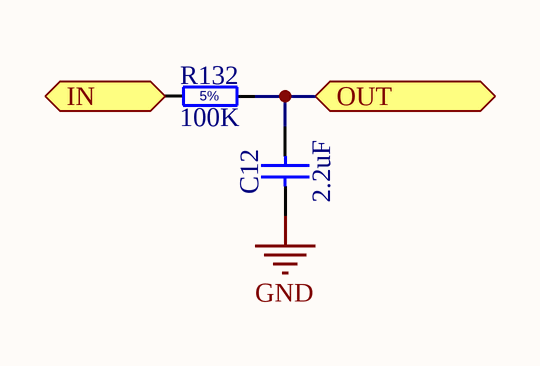
[diagram p4: ADC_Filter_Cell.SchDoc]

### Parts
C12  2.2uF  [CAPRR254-254X381X508]
R132  100K  [RES_ARCOL_RCC025]

### Ports
IN, OUT

### Nets
GND: C12.1
IN: R132.1 ; port IN
OUT: C12.2 R132.2 ; port OUT

### Channels
U_MCU_Module/FILT1: designators end in _FILT1; ports IN=СЕЛ_BUS1 OUT=FILT_BUS1
U_MCU_Module/FILT2: designators end in _FILT2; ports IN=СЕЛ_BUS2 OUT=FILT_BUS2
U_MCU_Module/FILT3: designators end in _FILT3; ports IN=СЕЛ_BUS3 OUT=FILT_BUS3
U_MCU_Module/FILT4: designators end in _FILT4; ports IN=СЕЛ_BUS4 OUT=FILT_BUS4

### Notes on the sheet
- (in symbol RCF_5K1_5%_0.25W_+10-6PPM_ARCOL_RCC025) 5%

### Library data of the parts
C12 = CCR_15PF_100V_5%_COG_254-254X381X508: as C1 on sheet TimerModule; Part Number: CCR_15PF_100V_5%_COG_254-254X381X508; Component Kind: Standard; Component Type: Standard; Pin Count: 2; Value: 2.2uF; Status: None; Manufacturer Part Number: CCR_15PF_100V_5%_COG_254-254X381X508; Case: LS2.54 W2.54 x L3.81 x H5.84; Mounted: Yes; Socket: No; SMD: No; ComponentHeight: 5.08mm; Manufacturer1 Example: AVX; Manufacturer1 ComponentHeight: 5.08mm; HelpURL: \\cern.ch\dfs\Applications\Altium\Datasheets\CCR_AVX_SR15.pdf; Author: CERN DEM JLC; CreateDate: 16.12.2010; LatestRevisionDate: 16.12.2010
R132 = RCF_5K1_5%_0.25W_+10-6PPM_ARCOL_RCC025: as R1#1 on sheet TimerModule; Part Number: RCF_5K1_5%_0.25W_+10-6PPM_ARCOL_RCC025; Component Kind: Standard; Component Type: Standard; Pin Count: 2; Value: 100K; Status: None; Tolerance: ±5%; Case: LS10.16 L6.3 x D2.4; Mounted: Yes; Socket: No; SMD: No; ComponentHeight: 2.5mm; HelpURL: \\cern.ch\dfs\Applications\Altium\Datasheets\RCF_ARCOL_RCC025.pdf; Author: CERN DEM JLC; CreateDate: 30.10.2013; LatestRevisionDate: 30.10.2013

## Nets that join several sheets
5V: MCU_Module (11 pins), U_MCU_Module/PNP1 (R1_PNP1.2 T1_PNP1.1), U_MCU_Module/PNP2 (R1_PNP2.2 T1_PNP2.1), U_MCU_Module/PNP3 (R1_PNP3.2 T1_PNP3.1), U_MCU_Module/PNP4 (R1_PNP4.2 T1_PNP4.1), U_MCU_Module/U_PNP_Cell (R1_U_PNP_Cell.2 T1_U_PNP_Cell.1)
GND: TimerModule (39 pins), MCU_Module (14 pins), U_MCU_Module/FILT1 (C12_FILT1.1), U_MCU_Module/FILT2 (C12_FILT2.1), U_MCU_Module/FILT3 (C12_FILT3.1), U_MCU_Module/FILT4 (C12_FILT4.1)
C_BUS: U_MCU_Module/PNP1 (T1_PNP1.3), U_MCU_Module/PNP2 (T1_PNP2.3), U_MCU_Module/PNP3 (T1_PNP3.3), U_MCU_Module/PNP4 (T1_PNP4.3)
RC_СТАРТ: MCU_Module (S1#2.7), U_MCU_Module/U_PNP_Cell (R2_U_PNP_Cell.1)
У_BUS: U_MCU_Module/PNP1 (R2_PNP1.1), U_MCU_Module/PNP2 (R2_PNP2.1), U_MCU_Module/PNP3 (R2_PNP3.1), U_MCU_Module/PNP4 (R2_PNP4.1)